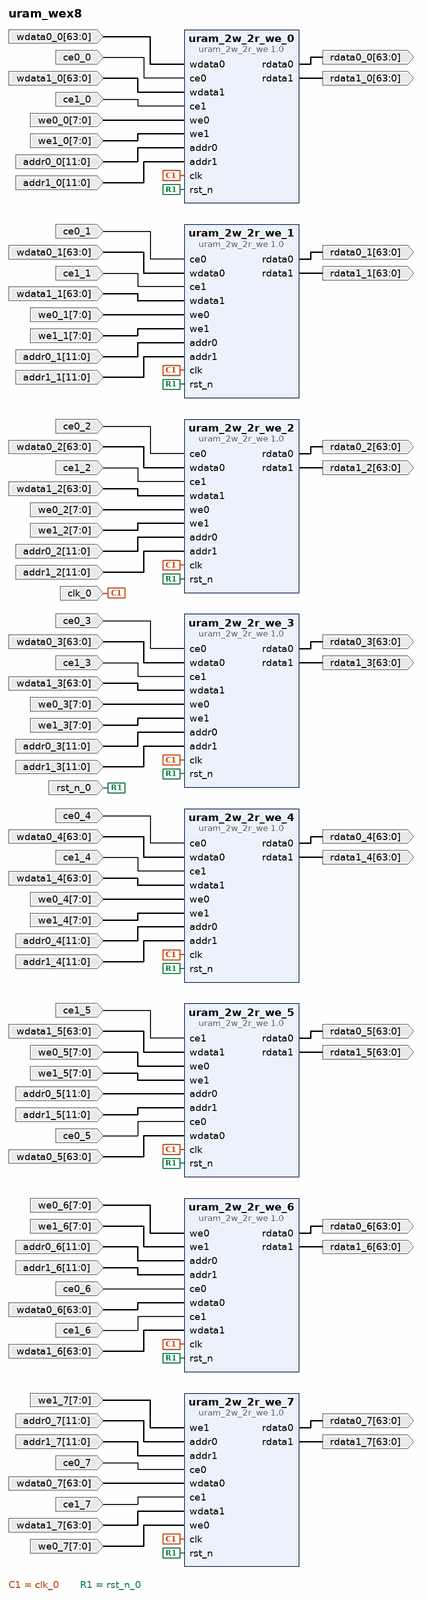
[diagram p0: block diagram of the top level]
# Vivado block design uram_wex8, xcu280-fsvh2892-2L-e, Vivado 2020.2
create_bd_design uram_wex8

create_bd_port -dir I -type clk clk_0
create_bd_port -dir I -type rst rst_n_0
create_bd_port -dir O -from 63 -to 0 rdata0_0
create_bd_port -dir O -from 63 -to 0 rdata1_0
create_bd_port -dir O -from 63 -to 0 rdata0_1
create_bd_port -dir O -from 63 -to 0 rdata1_1
create_bd_port -dir O -from 63 -to 0 rdata0_2
create_bd_port -dir O -from 63 -to 0 rdata1_2
create_bd_port -dir O -from 63 -to 0 rdata0_3
create_bd_port -dir O -from 63 -to 0 rdata1_3
create_bd_port -dir O -from 63 -to 0 rdata0_4
create_bd_port -dir O -from 63 -to 0 rdata1_4
create_bd_port -dir O -from 63 -to 0 rdata0_5
create_bd_port -dir O -from 63 -to 0 rdata1_5
create_bd_port -dir O -from 63 -to 0 rdata0_6
create_bd_port -dir O -from 63 -to 0 rdata1_6
create_bd_port -dir O -from 63 -to 0 rdata0_7
create_bd_port -dir O -from 63 -to 0 rdata1_7
create_bd_port -dir I -from 63 -to 0 wdata0_0
create_bd_port -dir I ce0_0
create_bd_port -dir I -from 63 -to 0 wdata1_0
create_bd_port -dir I ce1_0
create_bd_port -dir I -from 7 -to 0 we0_0
create_bd_port -dir I -from 7 -to 0 we1_0
create_bd_port -dir I -from 11 -to 0 addr0_0
create_bd_port -dir I -from 11 -to 0 addr1_0
create_bd_port -dir I ce0_1
create_bd_port -dir I -from 63 -to 0 wdata0_1
create_bd_port -dir I ce1_1
create_bd_port -dir I -from 63 -to 0 wdata1_1
create_bd_port -dir I -from 7 -to 0 we0_1
create_bd_port -dir I -from 7 -to 0 we1_1
create_bd_port -dir I -from 11 -to 0 addr0_1
create_bd_port -dir I -from 11 -to 0 addr1_1
create_bd_port -dir I ce0_2
create_bd_port -dir I -from 63 -to 0 wdata0_2
create_bd_port -dir I ce1_2
create_bd_port -dir I -from 63 -to 0 wdata1_2
create_bd_port -dir I -from 7 -to 0 we0_2
create_bd_port -dir I -from 7 -to 0 we1_2
create_bd_port -dir I -from 11 -to 0 addr0_2
create_bd_port -dir I -from 11 -to 0 addr1_2
create_bd_port -dir I ce0_3
create_bd_port -dir I -from 63 -to 0 wdata0_3
create_bd_port -dir I ce1_3
create_bd_port -dir I -from 63 -to 0 wdata1_3
create_bd_port -dir I -from 7 -to 0 we0_3
create_bd_port -dir I -from 7 -to 0 we1_3
create_bd_port -dir I -from 11 -to 0 addr0_3
create_bd_port -dir I -from 11 -to 0 addr1_3
create_bd_port -dir I ce0_4
create_bd_port -dir I -from 63 -to 0 wdata0_4
create_bd_port -dir I ce1_4
create_bd_port -dir I -from 63 -to 0 wdata1_4
create_bd_port -dir I -from 7 -to 0 we0_4
create_bd_port -dir I -from 7 -to 0 we1_4
create_bd_port -dir I -from 11 -to 0 addr0_4
create_bd_port -dir I -from 11 -to 0 addr1_4
create_bd_port -dir I ce1_5
create_bd_port -dir I -from 63 -to 0 wdata1_5
create_bd_port -dir I -from 7 -to 0 we0_5
create_bd_port -dir I -from 7 -to 0 we1_5
create_bd_port -dir I -from 11 -to 0 addr0_5
create_bd_port -dir I -from 11 -to 0 addr1_5
create_bd_port -dir I ce0_5
create_bd_port -dir I -from 63 -to 0 wdata0_5
create_bd_port -dir I -from 7 -to 0 we0_6
create_bd_port -dir I -from 7 -to 0 we1_6
create_bd_port -dir I -from 11 -to 0 addr0_6
create_bd_port -dir I -from 11 -to 0 addr1_6
create_bd_port -dir I ce0_6
create_bd_port -dir I -from 63 -to 0 wdata0_6
create_bd_port -dir I ce1_6
create_bd_port -dir I -from 63 -to 0 wdata1_6
create_bd_port -dir I -from 7 -to 0 we1_7
create_bd_port -dir I -from 11 -to 0 addr0_7
create_bd_port -dir I -from 11 -to 0 addr1_7
create_bd_port -dir I ce0_7
create_bd_port -dir I -from 63 -to 0 wdata0_7
create_bd_port -dir I ce1_7
create_bd_port -dir I -from 63 -to 0 wdata1_7
create_bd_port -dir I -from 7 -to 0 we0_7

create_bd_cell -type ip -vlnv user.org:user:uram_2w_2r_we:1.0 uram_2w_2r_we_0
create_bd_cell -type ip -vlnv user.org:user:uram_2w_2r_we:1.0 uram_2w_2r_we_1
create_bd_cell -type ip -vlnv user.org:user:uram_2w_2r_we:1.0 uram_2w_2r_we_2
create_bd_cell -type ip -vlnv user.org:user:uram_2w_2r_we:1.0 uram_2w_2r_we_3
create_bd_cell -type ip -vlnv user.org:user:uram_2w_2r_we:1.0 uram_2w_2r_we_4
create_bd_cell -type ip -vlnv user.org:user:uram_2w_2r_we:1.0 uram_2w_2r_we_5
create_bd_cell -type ip -vlnv user.org:user:uram_2w_2r_we:1.0 uram_2w_2r_we_6
create_bd_cell -type ip -vlnv user.org:user:uram_2w_2r_we:1.0 uram_2w_2r_we_7

# ---- connections ----

connect_bd_net -net clk_0_1 [get_bd_ports clk_0] \
  [get_bd_pins uram_2w_2r_we_0/clk] [get_bd_pins uram_2w_2r_we_1/clk] [get_bd_pins uram_2w_2r_we_2/clk] \
  [get_bd_pins uram_2w_2r_we_3/clk] [get_bd_pins uram_2w_2r_we_4/clk] [get_bd_pins uram_2w_2r_we_5/clk] \
  [get_bd_pins uram_2w_2r_we_6/clk] [get_bd_pins uram_2w_2r_we_7/clk]
connect_bd_net -net rst_n_0_1 [get_bd_ports rst_n_0] \
  [get_bd_pins uram_2w_2r_we_0/rst_n] [get_bd_pins uram_2w_2r_we_1/rst_n] [get_bd_pins uram_2w_2r_we_2/rst_n] \
  [get_bd_pins uram_2w_2r_we_3/rst_n] [get_bd_pins uram_2w_2r_we_4/rst_n] [get_bd_pins uram_2w_2r_we_5/rst_n] \
  [get_bd_pins uram_2w_2r_we_6/rst_n] [get_bd_pins uram_2w_2r_we_7/rst_n]
connect_bd_net [get_bd_pins uram_2w_2r_we_0/rdata0] [get_bd_ports rdata0_0]
connect_bd_net [get_bd_pins uram_2w_2r_we_0/rdata1] [get_bd_ports rdata1_0]
connect_bd_net [get_bd_pins uram_2w_2r_we_1/rdata0] [get_bd_ports rdata0_1]
connect_bd_net [get_bd_pins uram_2w_2r_we_1/rdata1] [get_bd_ports rdata1_1]
connect_bd_net [get_bd_pins uram_2w_2r_we_2/rdata0] [get_bd_ports rdata0_2]
connect_bd_net [get_bd_pins uram_2w_2r_we_2/rdata1] [get_bd_ports rdata1_2]
connect_bd_net [get_bd_pins uram_2w_2r_we_3/rdata0] [get_bd_ports rdata0_3]
connect_bd_net [get_bd_pins uram_2w_2r_we_3/rdata1] [get_bd_ports rdata1_3]
connect_bd_net [get_bd_pins uram_2w_2r_we_4/rdata0] [get_bd_ports rdata0_4]
connect_bd_net [get_bd_pins uram_2w_2r_we_4/rdata1] [get_bd_ports rdata1_4]
connect_bd_net [get_bd_pins uram_2w_2r_we_5/rdata0] [get_bd_ports rdata0_5]
connect_bd_net [get_bd_pins uram_2w_2r_we_5/rdata1] [get_bd_ports rdata1_5]
connect_bd_net [get_bd_pins uram_2w_2r_we_6/rdata0] [get_bd_ports rdata0_6]
connect_bd_net [get_bd_pins uram_2w_2r_we_6/rdata1] [get_bd_ports rdata1_6]
connect_bd_net [get_bd_pins uram_2w_2r_we_7/rdata0] [get_bd_ports rdata0_7]
connect_bd_net [get_bd_pins uram_2w_2r_we_7/rdata1] [get_bd_ports rdata1_7]
connect_bd_net -net wdata0_0_1 [get_bd_ports wdata0_0] [get_bd_pins uram_2w_2r_we_0/wdata0]
connect_bd_net -net ce0_0_1 [get_bd_ports ce0_0] [get_bd_pins uram_2w_2r_we_0/ce0]
connect_bd_net -net wdata1_0_1 [get_bd_ports wdata1_0] [get_bd_pins uram_2w_2r_we_0/wdata1]
connect_bd_net -net ce1_0_1 [get_bd_ports ce1_0] [get_bd_pins uram_2w_2r_we_0/ce1]
connect_bd_net -net we0_0_1 [get_bd_ports we0_0] [get_bd_pins uram_2w_2r_we_0/we0]
connect_bd_net -net we1_0_1 [get_bd_ports we1_0] [get_bd_pins uram_2w_2r_we_0/we1]
connect_bd_net -net addr0_0_1 [get_bd_ports addr0_0] [get_bd_pins uram_2w_2r_we_0/addr0]
connect_bd_net -net addr1_0_1 [get_bd_ports addr1_0] [get_bd_pins uram_2w_2r_we_0/addr1]
connect_bd_net -net ce0_1_1 [get_bd_ports ce0_1] [get_bd_pins uram_2w_2r_we_1/ce0]
connect_bd_net -net wdata0_1_1 [get_bd_ports wdata0_1] [get_bd_pins uram_2w_2r_we_1/wdata0]
connect_bd_net -net ce1_1_1 [get_bd_ports ce1_1] [get_bd_pins uram_2w_2r_we_1/ce1]
connect_bd_net -net wdata1_1_1 [get_bd_ports wdata1_1] [get_bd_pins uram_2w_2r_we_1/wdata1]
connect_bd_net -net we0_1_1 [get_bd_ports we0_1] [get_bd_pins uram_2w_2r_we_1/we0]
connect_bd_net -net we1_1_1 [get_bd_ports we1_1] [get_bd_pins uram_2w_2r_we_1/we1]
connect_bd_net -net addr0_1_1 [get_bd_ports addr0_1] [get_bd_pins uram_2w_2r_we_1/addr0]
connect_bd_net -net addr1_1_1 [get_bd_ports addr1_1] [get_bd_pins uram_2w_2r_we_1/addr1]
connect_bd_net -net ce0_2_1 [get_bd_ports ce0_2] [get_bd_pins uram_2w_2r_we_2/ce0]
connect_bd_net -net wdata0_2_1 [get_bd_ports wdata0_2] [get_bd_pins uram_2w_2r_we_2/wdata0]
connect_bd_net -net ce1_2_1 [get_bd_ports ce1_2] [get_bd_pins uram_2w_2r_we_2/ce1]
connect_bd_net -net wdata1_2_1 [get_bd_ports wdata1_2] [get_bd_pins uram_2w_2r_we_2/wdata1]
connect_bd_net -net we0_2_1 [get_bd_ports we0_2] [get_bd_pins uram_2w_2r_we_2/we0]
connect_bd_net -net we1_2_1 [get_bd_ports we1_2] [get_bd_pins uram_2w_2r_we_2/we1]
connect_bd_net -net addr0_2_1 [get_bd_ports addr0_2] [get_bd_pins uram_2w_2r_we_2/addr0]
connect_bd_net -net addr1_2_1 [get_bd_ports addr1_2] [get_bd_pins uram_2w_2r_we_2/addr1]
connect_bd_net -net ce0_3_1 [get_bd_ports ce0_3] [get_bd_pins uram_2w_2r_we_3/ce0]
connect_bd_net -net wdata0_3_1 [get_bd_ports wdata0_3] [get_bd_pins uram_2w_2r_we_3/wdata0]
connect_bd_net -net ce1_3_1 [get_bd_ports ce1_3] [get_bd_pins uram_2w_2r_we_3/ce1]
connect_bd_net -net wdata1_3_1 [get_bd_ports wdata1_3] [get_bd_pins uram_2w_2r_we_3/wdata1]
connect_bd_net -net we0_3_1 [get_bd_ports we0_3] [get_bd_pins uram_2w_2r_we_3/we0]
connect_bd_net -net we1_3_1 [get_bd_ports we1_3] [get_bd_pins uram_2w_2r_we_3/we1]
connect_bd_net -net addr0_3_1 [get_bd_ports addr0_3] [get_bd_pins uram_2w_2r_we_3/addr0]
connect_bd_net -net addr1_3_1 [get_bd_ports addr1_3] [get_bd_pins uram_2w_2r_we_3/addr1]
connect_bd_net -net ce0_4_1 [get_bd_ports ce0_4] [get_bd_pins uram_2w_2r_we_4/ce0]
connect_bd_net -net wdata0_4_1 [get_bd_ports wdata0_4] [get_bd_pins uram_2w_2r_we_4/wdata0]
connect_bd_net -net ce1_4_1 [get_bd_ports ce1_4] [get_bd_pins uram_2w_2r_we_4/ce1]
connect_bd_net -net wdata1_4_1 [get_bd_ports wdata1_4] [get_bd_pins uram_2w_2r_we_4/wdata1]
connect_bd_net -net we0_4_1 [get_bd_ports we0_4] [get_bd_pins uram_2w_2r_we_4/we0]
connect_bd_net -net we1_4_1 [get_bd_ports we1_4] [get_bd_pins uram_2w_2r_we_4/we1]
connect_bd_net -net addr0_4_1 [get_bd_ports addr0_4] [get_bd_pins uram_2w_2r_we_4/addr0]
connect_bd_net -net addr1_4_1 [get_bd_ports addr1_4] [get_bd_pins uram_2w_2r_we_4/addr1]
connect_bd_net -net ce1_5_1 [get_bd_ports ce1_5] [get_bd_pins uram_2w_2r_we_5/ce1]
connect_bd_net -net wdata1_5_1 [get_bd_ports wdata1_5] [get_bd_pins uram_2w_2r_we_5/wdata1]
connect_bd_net -net we0_5_1 [get_bd_ports we0_5] [get_bd_pins uram_2w_2r_we_5/we0]
connect_bd_net -net we1_5_1 [get_bd_ports we1_5] [get_bd_pins uram_2w_2r_we_5/we1]
connect_bd_net -net addr0_5_1 [get_bd_ports addr0_5] [get_bd_pins uram_2w_2r_we_5/addr0]
connect_bd_net -net addr1_5_1 [get_bd_ports addr1_5] [get_bd_pins uram_2w_2r_we_5/addr1]
connect_bd_net -net ce0_5_1 [get_bd_ports ce0_5] [get_bd_pins uram_2w_2r_we_5/ce0]
connect_bd_net -net wdata0_5_1 [get_bd_ports wdata0_5] [get_bd_pins uram_2w_2r_we_5/wdata0]
connect_bd_net -net we0_6_1 [get_bd_ports we0_6] [get_bd_pins uram_2w_2r_we_6/we0]
connect_bd_net -net we1_6_1 [get_bd_ports we1_6] [get_bd_pins uram_2w_2r_we_6/we1]
connect_bd_net -net addr0_6_1 [get_bd_ports addr0_6] [get_bd_pins uram_2w_2r_we_6/addr0]
connect_bd_net -net addr1_6_1 [get_bd_ports addr1_6] [get_bd_pins uram_2w_2r_we_6/addr1]
connect_bd_net -net ce0_6_1 [get_bd_ports ce0_6] [get_bd_pins uram_2w_2r_we_6/ce0]
connect_bd_net -net wdata0_6_1 [get_bd_ports wdata0_6] [get_bd_pins uram_2w_2r_we_6/wdata0]
connect_bd_net -net ce1_6_1 [get_bd_ports ce1_6] [get_bd_pins uram_2w_2r_we_6/ce1]
connect_bd_net -net wdata1_6_1 [get_bd_ports wdata1_6] [get_bd_pins uram_2w_2r_we_6/wdata1]
connect_bd_net -net we1_7_1 [get_bd_ports we1_7] [get_bd_pins uram_2w_2r_we_7/we1]
connect_bd_net -net addr0_7_1 [get_bd_ports addr0_7] [get_bd_pins uram_2w_2r_we_7/addr0]
connect_bd_net -net addr1_7_1 [get_bd_ports addr1_7] [get_bd_pins uram_2w_2r_we_7/addr1]
connect_bd_net -net ce0_7_1 [get_bd_ports ce0_7] [get_bd_pins uram_2w_2r_we_7/ce0]
connect_bd_net -net wdata0_7_1 [get_bd_ports wdata0_7] [get_bd_pins uram_2w_2r_we_7/wdata0]
connect_bd_net -net ce1_7_1 [get_bd_ports ce1_7] [get_bd_pins uram_2w_2r_we_7/ce1]
connect_bd_net -net wdata1_7_1 [get_bd_ports wdata1_7] [get_bd_pins uram_2w_2r_we_7/wdata1]
connect_bd_net -net we0_7_1 [get_bd_ports we0_7] [get_bd_pins uram_2w_2r_we_7/we0]

validate_bd_design
save_bd_design
